# Altium schematic sheet Sheet10.SchDoc
size A3; SheetNumber: 1; SheetTotal: 4
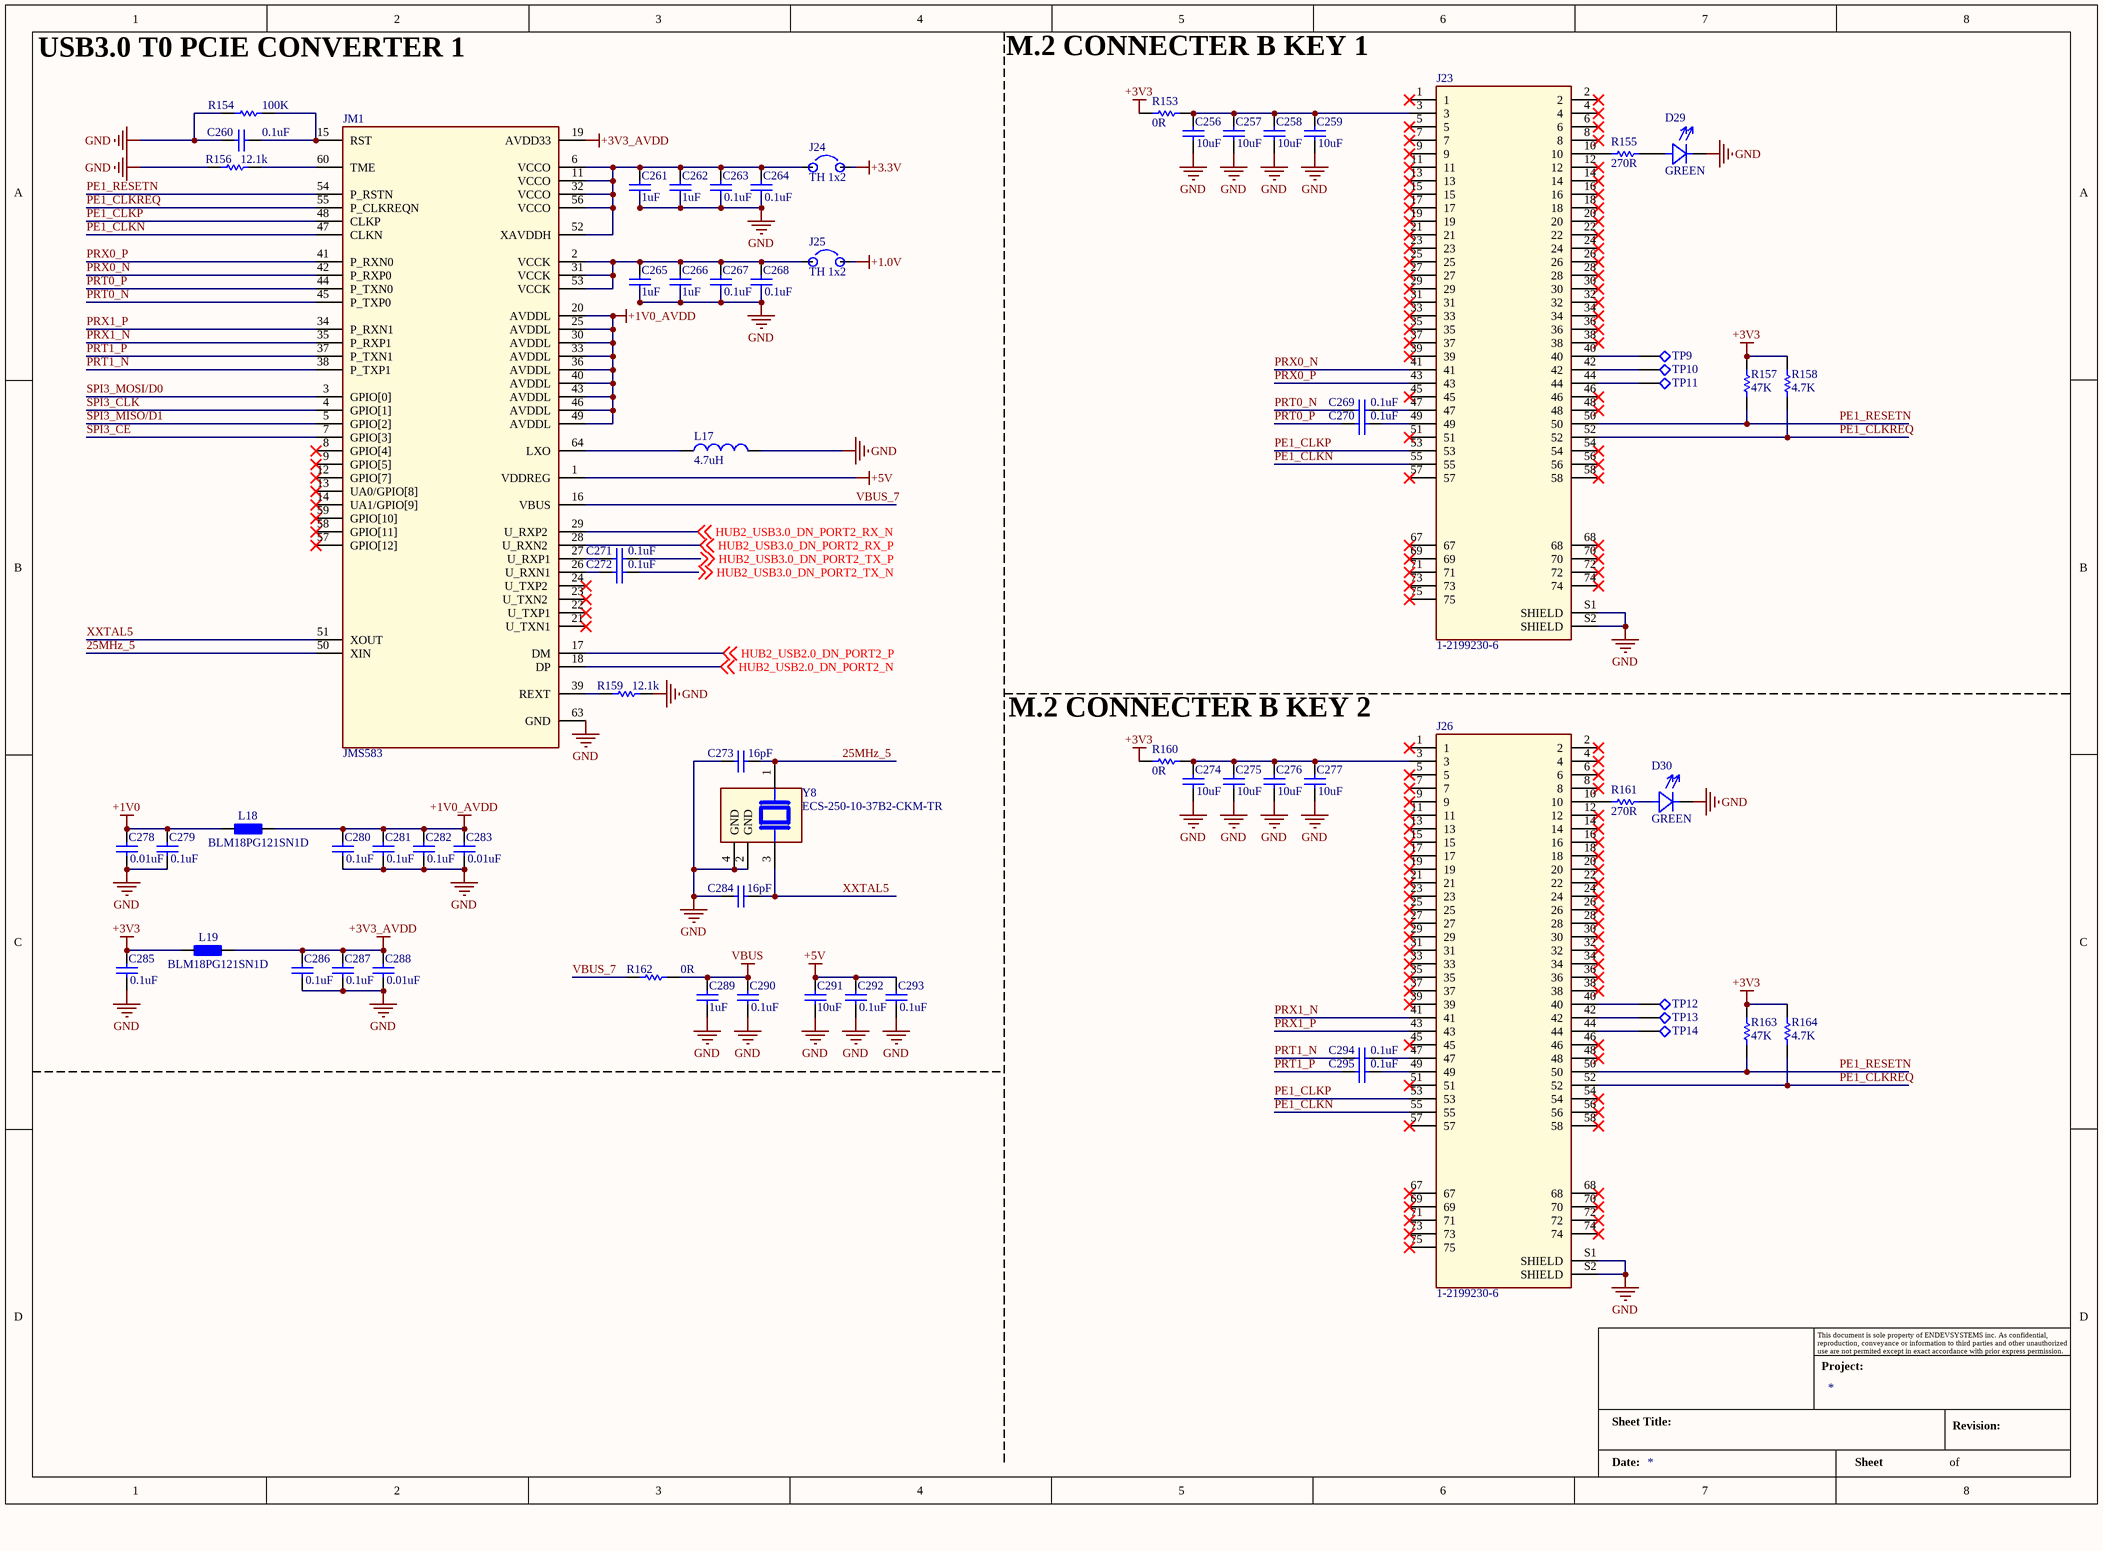
[diagram p0: Sheet10.SchDoc]

## Parts
?  Title_Block  (value not drawn)  (graphical)
C256  value 10uF  [C-0603/1608]  (hidden comment: 10uF_6.3V)
C257  value 10uF  [C-0603/1608]  (hidden comment: 10uF_6.3V)
C258  value 10uF  [C-0603/1608]  (hidden comment: 10uF_6.3V)
C259  value 10uF  [C-0603/1608]  (hidden comment: 10uF_6.3V)
C260  value 0.1uF  [C-0402/1005]  (hidden comment: 0.01uF)
C261  1uF  [C-0402/1005]
C262  1uF  [C-0402/1005]
C263  0.1uF  [C-0402/1005]
C264  0.1uF  [C-0402/1005]
C265  1uF  [C-0402/1005]
C266  1uF  [C-0402/1005]
C267  0.1uF  [C-0402/1005]
C268  0.1uF  [C-0402/1005]
C269  0.1uF  [C-0402/1005]
C270  0.1uF  [C-0402/1005]
C271  0.1uF  [C-0402/1005]
C272  0.1uF  [C-0402/1005]
C273  16pF  [C-0402/1005]
C274  value 10uF  [C-0603/1608]  (hidden comment: 10uF_6.3V)
C275  value 10uF  [C-0603/1608]  (hidden comment: 10uF_6.3V)
C276  value 10uF  [C-0603/1608]  (hidden comment: 10uF_6.3V)
C277  value 10uF  [C-0603/1608]  (hidden comment: 10uF_6.3V)
C278  0.01uF  [C-0603/1608]
C279  0.1uF  [C-0603/1608]
C280  0.1uF  [C-0603/1608]
C281  0.1uF  [C-0603/1608]
C282  0.1uF  [C-0603/1608]
C283  0.01uF  [C-0603/1608]
C284  16pF  [C-0402/1005]
C285  0.1uF  [C-0603/1608]
C286  0.1uF  [C-0603/1608]
C287  0.1uF  [C-0603/1608]
C288  0.01uF  [C-0603/1608]
C289  1uF  [C-0402/1005]
C290  0.1uF  [C-0402/1005]
C291  10uF  [CAPC1608X100N]
C292  0.1uF  [C-0402/1005]
C293  0.1uF  [C-0402/1005]
C294  0.1uF  [C-0402/1005]
C295  0.1uF  [C-0402/1005]
D29  GREEN  [LEDC1608X65N]
D30  GREEN  [LEDC1608X65N]
J23  1-2199230-6  [TE_1-2199230-6]
J24  TH 1x2  [PIN HEADER 1x2 2.54mm]
J25  TH 1x2  [PIN HEADER 1x2 2.54mm]
J26  1-2199230-6  [TE_1-2199230-6]
JM1  JMS583  [QFN-64]
L17  4.7uH  [IND_SPM6550T-4R7M]
L18  BLM18PG121SN1D  [BEADC1608X95N]
L19  BLM18PG121SN1D  [BEADC1608X95N]
R153  0R  [R-0603/1608]
R154  100K  [R-0402/1005]
R155  270R  [R-0402/1005]
R156  12.1k  [R-0402/1005]
R157  47K  [R-0603/1608]
R158  4.7K  [R-0603/1608]
R159  12.1k  [R-0402/1005]
R160  0R  [R-0603/1608]
R161  270R  [R-0402/1005]
R162  0R  [R-0603/1608]
R163  47K  [R-0603/1608]
R164  4.7K  [R-0603/1608]
TP9  Test Points  [Test Point TH Round H0.9,D1.6]  (value not drawn)
TP10  Test Points  [Test Point TH Round H0.9,D1.6]  (value not drawn)
TP11  Test Points  [Test Point TH Round H0.9,D1.6]  (value not drawn)
TP12  Test Points  [Test Point TH Round H0.9,D1.6]  (value not drawn)
TP13  Test Points  [Test Point TH Round H0.9,D1.6]  (value not drawn)
TP14  Test Points  [Test Point TH Round H0.9,D1.6]  (value not drawn)
Y8  ECS-250-10-37B2-CKM-TR  [ECS-250-10-37B2]

## Nets
+1.0V: J25.1
+1V0: C278.2 C279.2 L18.2
+1V0_AVDD: C280.2 C281.2 C282.2 C283.2 JM1.20(AVDDL) JM1.25(AVDDL) JM1.30(AVDDL) JM1.33(AVDDL) JM1.36(AVDDL) JM1.40(AVDDL) JM1.43(AVDDL) JM1.46(AVDDL) JM1.49(AVDDL) L18.1
+3.3V: J24.1
+3V3: C285.2 L19.2 R153.2 R157.2 R158.2 R160.2 R163.2 R164.2
+3V3_AVDD: C286.2 C287.2 C288.2 JM1.19(AVDD33) L19.1
+5V: C291.2 C292.2 C293.2 JM1.1(VDDREG)
GND: C256.1 C257.1 C258.1 C259.1 C260.1 C261.1 C262.1 C263.1 C264.1 C265.1 C266.1 C267.1 C268.1 C273.2 C274.1 C275.1 C276.1 C277.1 C278.1 C279.1 C280.1 C281.1 C282.1 C283.1 C284.2 C285.1 C286.1 C287.1 C288.1 C289.1 C290.1 C291.1 C292.1 C293.1 D29.C D30.C J23.S1(SHIELD) J23.S2(SHIELD) J26.S1(SHIELD) J26.S2(SHIELD) JM1.63(GND) L17.2 R154.2 R156.2 R159.1 Y8.2(GND) Y8.4(GND)
VBUS: C289.2 C290.2 R162.2
25MHz_5: C273.1 JM1.50(XIN) Y8.1
HUB2_USB2.0_DN_PORT2_N: JM1.18(DP) ; off-sheet HUB2_USB2.0_DN_PORT2_N
HUB2_USB2.0_DN_PORT2_P: JM1.17(DM) ; off-sheet HUB2_USB2.0_DN_PORT2_P
HUB2_USB3.0_DN_PORT2_RX_N: JM1.29(U_RXP2) ; off-sheet HUB2_USB3.0_DN_PORT2_RX_N
HUB2_USB3.0_DN_PORT2_RX_P: JM1.28(U_RXN2) ; off-sheet HUB2_USB3.0_DN_PORT2_RX_P
HUB2_USB3.0_DN_PORT2_TX_N: C272.1 ; off-sheet HUB2_USB3.0_DN_PORT2_TX_N
HUB2_USB3.0_DN_PORT2_TX_P: C271.1 ; off-sheet HUB2_USB3.0_DN_PORT2_TX_P
PE1_CLKN: J23.55 J26.55 JM1.47(CLKN)
PE1_CLKP: J23.53 J26.53 JM1.48(CLKP)
PE1_CLKREQ: J23.52 J26.52 JM1.55(P_CLKREQN) R158.1 R164.1
PE1_RESETN: J23.50 J26.50 JM1.54(P_RSTN) R157.1 R163.1
PRT0_N: C269.2 JM1.45(P_TXP0)
PRT0_P: C270.2 JM1.44(P_TXN0)
PRT1_N: C294.2 JM1.38(P_TXP1)
PRT1_P: C295.2 JM1.37(P_TXN1)
PRX0_N: J23.41 JM1.42(P_RXP0)
PRX0_P: J23.43 JM1.41(P_RXN0)
PRX1_N: J26.41 JM1.35(P_RXP1)
PRX1_P: J26.43 JM1.34(P_RXN1)
SPI3_CE: JM1.7(GPIO[3])
SPI3_CLK: JM1.4(GPIO[1])
SPI3_MISO/D1: JM1.5(GPIO[2])
SPI3_MOSI/D0: JM1.3(GPIO[0])
VBUS_7: JM1.16(VBUS) R162.1
XXTAL5: C284.1 JM1.51(XOUT) Y8.3
NetC256_2: C256.2 C257.2 C258.2 C259.2 J23.3 R153.1
NetC260_2: C260.2 JM1.15(RST) R154.1
NetC261_2: C261.2 C262.2 C263.2 C264.2 J24.2 JM1.6(VCCO) JM1.11(VCCO) JM1.32(VCCO) JM1.52(XAVDDH) JM1.56(VCCO)
NetC265_2: C265.2 C266.2 C267.2 C268.2 J25.2 JM1.2(VCCK) JM1.31(VCCK) JM1.53(VCCK)
NetC269_1: C269.1 J23.47
NetC270_1: C270.1 J23.49
NetC271_2: C271.2 JM1.27(U_RXP1)
NetC272_2: C272.2 JM1.26(U_RXN1)
NetC274_2: C274.2 C275.2 C276.2 C277.2 J26.3 R160.1
NetC294_1: C294.1 J26.47
NetC295_1: C295.1 J26.49
NetD29_A: D29.A R155.1
NetD30_A: D30.A R161.1
NetJ23_10: J23.10 R155.2
NetJ23_40: J23.40 TP9.1
NetJ23_42: J23.42 TP10.1
NetJ23_44: J23.44 TP11.1
NetJ26_10: J26.10 R161.2
NetJ26_40: J26.40 TP12.1
NetJ26_42: J26.42 TP13.1
NetJ26_44: J26.44 TP14.1
NetJM1_39: JM1.39(REXT) R159.2
NetJM1_60: JM1.60(TME) R156.1
NetJM1_64: JM1.64(LXO) L17.1

Not connected (* = marked no-connect by the designer): J23 1* 2* 4* 5* 6* 7* 8* 9* 11* 12* 13* 14* 15* 16* 17* 18* 19* 20* 21* 22* 23* 24* 25* 26* 27* 28* 29* 30* 31* 32* 33* 34* 35* 36* 37* 38* 39* 45* 46* 48* 51* 54* 56* 57* 58* 67* 68* 69* 70* 71* 72* 73* 74* 75*; J26 1* 2* 4* 5* 6* 7* 8* 9* 11* 12* 13* 14* 15* 16* 17* 18* 19* 20* 21* 22* 23* 24* 25* 26* 27* 28* 29* 30* 31* 32* 33* 34* 35* 36* 37* 38* 39* 45* 46* 48* 51* 54* 56* 57* 58* 67* 68* 69* 70* 71* 72* 73* 74* 75*; JM1 8(GPIO[4])* 9(GPIO[5])* 12(GPIO[7])* 13(UA0/GPIO[8])* 14(UA1/GPIO[9])* 21(U_TXN1)* 22(U_TXP1)* 23(U_TXN2_)* 24(U_TXP2_)* 57(GPIO[12])* 58(GPIO[11])* 59(GPIO[10])*

## Notes on the sheet
- USB3.0 T0 PCIE CONVERTER 1
- M.2 CONNECTER B KEY 1
- M.2 CONNECTER B KEY 2
- (in symbol Title_Block) This document is sole property of ENDEVSYSTEMS inc. As confidential, reproduction, conveyance or information to third parties and other unauthorized use are not permited except in exact accordance with prior express permission.; Project:; Sheet Title:; Revision:; Date:; Sheet; of

## Library data of the parts
C256-C259 C274-C277 = Cap: 10uF_6.3V / C0603; Published: 8-Jun-2000; LatestRevisionDate: 17-Jul-2002; LatestRevisionNote: Re-released for DXP Platform.; PackageReference: RAD-0.3; Publisher: Altium Limited; PackageDescription: Radial Cap, Thru-Hole; 2 Leads; 0.3 in Pin Spacing
C260 C263 C264 C267-C272 C290 C292-C295 = Cap: Capacitor; Published: 8-Jun-2000; LatestRevisionDate: 17-Jul-2002; LatestRevisionNote: Re-released for DXP Platform.; PackageReference: RAD-0.3; Publisher: Altium Limited; PackageDescription: Radial Cap, Thru-Hole; 2 Leads; 0.3 in Pin Spacing
  C263 C264 C267-C272 C290 C292-C295: Value: 0.1uF
C261 C262 C265 C266 C273 C284 C289 C291 = Cap: Capacitor; Value: 0.1uF; Published: 8-Jun-2000; LatestRevisionDate: 17-Jul-2002; LatestRevisionNote: Re-released for DXP Platform.; PackageReference: RAD-0.3; Publisher: Altium Limited; PackageDescription: Radial Cap, Thru-Hole; 2 Leads; 0.3 in Pin Spacing
C278-C283 C285-C288 = Cap: Published: 8-Jun-2000; LatestRevisionDate: 17-Jul-2002; LatestRevisionNote: Re-released for DXP Platform.; PackageReference: RAD-0.3; Publisher: Altium Limited; PackageDescription: Radial Cap, Thru-Hole; 2 Leads; 0.3 in Pin Spacing
  C278 C283 C288: Value: 0.01uF
  C279-C282 C285-C287: Value: 0.1uF
D29 D30 = Diode-LED: Supplier: Digikey Electronics
J23 J26 = 1-2199230-6: M.2 0.5PITCH 4.2H KEY M 30U AU; MF: TE Connectivity; Package: None; Digi-Key_Part_Number: A118046TR-ND; Purchase-URL: https://pricing.snapeda.com/search/part/1-2199230-6/?ref=eda; Check_prices: https://www.snapeda.com/parts/1-2199230-6/TE+Connectivity+AMP+Connectors/view-part/?ref=eda; MP: 1-2199230-6; SnapEDA_Link: https://www.snapeda.com/parts/1-2199230-6/TE+Connectivity+AMP+Connectors/view-part/?ref=snap; Value: *
J24 J25 = Jumper 2 pin: CONN HEADER VERT 3POS 2.54MM; Mfr. Part No.: 75160-156-03LF; Value: 51R; Unit Price (USD): 0.74; Supplier Part No.: 609-75160-156-03LF-ND; Supplier: Digikey Electronics
JM1 = JMS583: USB 3.1 Gen 2 to PCIe Gen3x2 Bridge
L17 = Inductor: Code_IEC: 1005; Value: 10mH; Published: 8-Jun-2000; LatestRevisionDate: 29-May-2009; LatestRevisionNote: IPC-7351 Footprint Added.; PackageReference: 0402-A; Publisher: Altium Limited; PackageDescription: Chip Inductor; Code_JEITA: 0402
L18 L19 = BLM15H: 120 Ohms @ 100 MHz 1 Power Line Ferrite Bead 0603 (1608 Metric) 2A 50mOhm; Mfr. Part No.: BLM15HB121SN1D; Unit Price (USD): 0.19; Supplier Part No.: 490-4000-1-ND; Supplier: Digikey Electronics
R153 R157 R158 R160 R162-R164 = Res1: Resistor; Value: 200K; Published: 8-Jun-2000; LatestRevisionDate: 17-Jul-2002; LatestRevisionNote: Re-released for DXP Platform.; PackageReference: AXIAL-0.3; Publisher: Altium Limited; PackageDescription: Axial Device, Thru-Hole; 2 Leads; 0.3 in Pin Spacing
R154-R156 R159 R161 = Res1: Resistor; Value: 10K; Published: 8-Jun-2000; LatestRevisionDate: 17-Jul-2002; LatestRevisionNote: Re-released for DXP Platform.; PackageReference: AXIAL-0.3; Publisher: Altium Limited; PackageDescription: Axial Device, Thru-Hole; 2 Leads; 0.3 in Pin Spacing
? = Title_Block: Date:: *; Project:: *